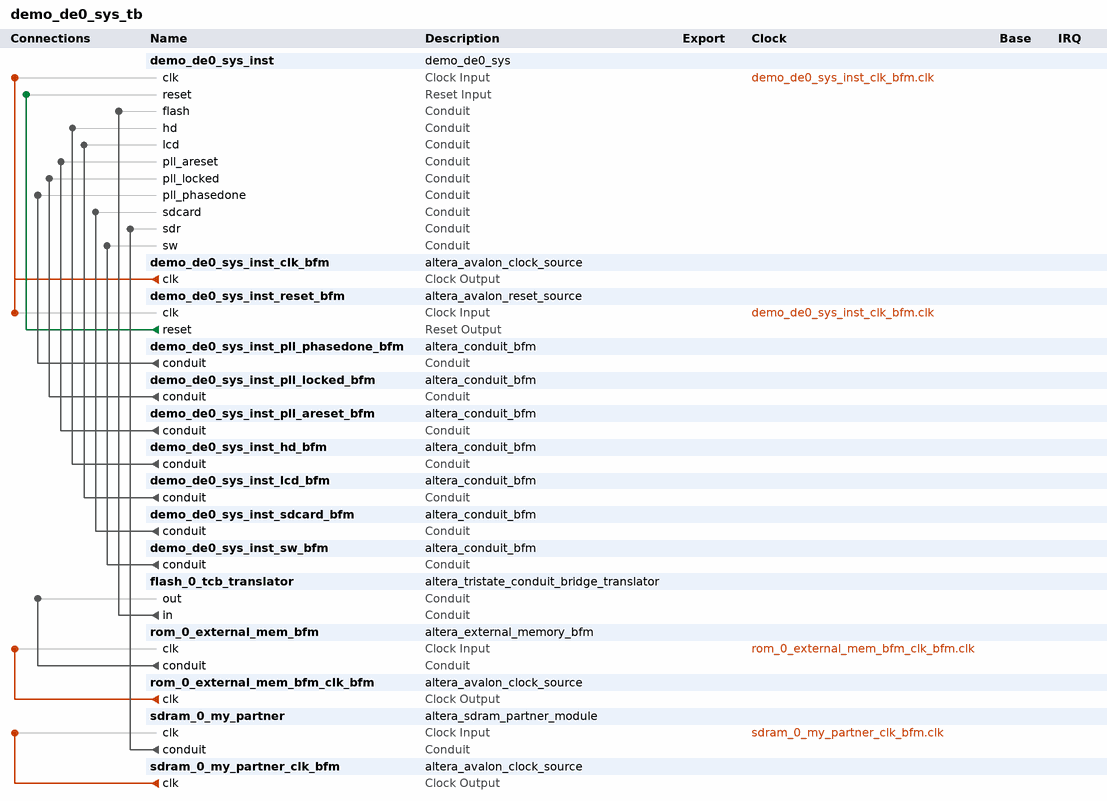
[diagram p0: system contents]
# Platform Designer (Qsys) system demo_de0_sys_tb
# Parameters at their usual value, and those the tool derives, are not listed.
package require -exact qsys 11.1
create_system demo_de0_sys_tb
set_project_property DEVICE_FAMILY CYCLONEIII

add_instance demo_de0_sys_inst demo_de0_sys 1.0

add_instance demo_de0_sys_inst_clk_bfm altera_avalon_clock_source 11.1
set_instance_parameter_value demo_de0_sys_inst_clk_bfm CLOCK_RATE 50

add_instance demo_de0_sys_inst_reset_bfm altera_avalon_reset_source 11.1
set_instance_parameter_value demo_de0_sys_inst_reset_bfm ASSERT_HIGH_RESET 0
set_instance_parameter_value demo_de0_sys_inst_reset_bfm INITIAL_RESET_CYCLES 50

add_instance demo_de0_sys_inst_pll_phasedone_bfm altera_conduit_bfm 11.1
set_instance_parameter_value demo_de0_sys_inst_pll_phasedone_bfm SIGNAL_WIDTHS 1
set_instance_parameter_value demo_de0_sys_inst_pll_phasedone_bfm SIGNAL_DIRECTIONS input

add_instance demo_de0_sys_inst_pll_locked_bfm altera_conduit_bfm 11.1
set_instance_parameter_value demo_de0_sys_inst_pll_locked_bfm SIGNAL_WIDTHS 1
set_instance_parameter_value demo_de0_sys_inst_pll_locked_bfm SIGNAL_DIRECTIONS input

add_instance demo_de0_sys_inst_pll_areset_bfm altera_conduit_bfm 11.1
set_instance_parameter_value demo_de0_sys_inst_pll_areset_bfm SIGNAL_WIDTHS 1
set_instance_parameter_value demo_de0_sys_inst_pll_areset_bfm SIGNAL_DIRECTIONS output

add_instance demo_de0_sys_inst_hd_bfm altera_conduit_bfm 11.1
set_instance_parameter_value demo_de0_sys_inst_hd_bfm SIGNAL_ROLES a,b,c,d,e,f,g,dp
set_instance_parameter_value demo_de0_sys_inst_hd_bfm SIGNAL_WIDTHS 4,4,4,4,4,4,4,4
set_instance_parameter_value demo_de0_sys_inst_hd_bfm SIGNAL_DIRECTIONS input,input,input,input,input,input,input,input

add_instance demo_de0_sys_inst_lcd_bfm altera_conduit_bfm 11.1
set_instance_parameter_value demo_de0_sys_inst_lcd_bfm SIGNAL_ROLES reset_n,cs,rs,data,write_n,read_n
set_instance_parameter_value demo_de0_sys_inst_lcd_bfm SIGNAL_WIDTHS 1,1,1,16,1,1
set_instance_parameter_value demo_de0_sys_inst_lcd_bfm SIGNAL_DIRECTIONS input,input,input,bidir,input,input

add_instance demo_de0_sys_inst_sdcard_bfm altera_conduit_bfm 11.1
set_instance_parameter_value demo_de0_sys_inst_sdcard_bfm SIGNAL_ROLES MISO,MOSI,SCLK,SS_n
set_instance_parameter_value demo_de0_sys_inst_sdcard_bfm SIGNAL_WIDTHS 1,1,1,1
set_instance_parameter_value demo_de0_sys_inst_sdcard_bfm SIGNAL_DIRECTIONS output,input,input,input

add_instance demo_de0_sys_inst_sw_bfm altera_conduit_bfm 11.1
set_instance_parameter_value demo_de0_sys_inst_sw_bfm SIGNAL_WIDTHS 12
set_instance_parameter_value demo_de0_sys_inst_sw_bfm SIGNAL_DIRECTIONS output

add_instance flash_0_tcb_translator altera_tristate_conduit_bridge_translator 11.1
set_instance_parameter_value flash_0_tcb_translator CHAIN_LENGTH 4
set_instance_parameter_value flash_0_tcb_translator MODULE_ORIGIN_LIST rom_0.tcm,rom_0.tcm,rom_0.tcm,rom_0.tcm,rom_0.tcm
set_instance_parameter_value flash_0_tcb_translator SIGNAL_ORIGIN_LIST tcm_address_out,tcm_read_n_out,tcm_write_n_out,tcm_data_out,tcm_chipselect_n_out
set_instance_parameter_value flash_0_tcb_translator SIGNAL_ORIGIN_TYPE Output,Output,Output,Bidirectional,Output
set_instance_parameter_value flash_0_tcb_translator SIGNAL_ORIGIN_WIDTH 22,1,1,16,1

add_instance rom_0_external_mem_bfm altera_external_memory_bfm 11.1
set_instance_parameter_value rom_0_external_mem_bfm USE_BYTEENABLE 0
set_instance_parameter_value rom_0_external_mem_bfm USE_CHIPSELECT 1
set_instance_parameter_value rom_0_external_mem_bfm USE_WRITE 1
set_instance_parameter_value rom_0_external_mem_bfm USE_READ 1
set_instance_parameter_value rom_0_external_mem_bfm USE_OUTPUTENABLE 0
set_instance_parameter_value rom_0_external_mem_bfm USE_BEGINTRANSFER 0
set_instance_parameter_value rom_0_external_mem_bfm USE_RESET 0
set_instance_parameter_value rom_0_external_mem_bfm ACTIVE_LOW_BYTEENABLE 0
set_instance_parameter_value rom_0_external_mem_bfm ACTIVE_LOW_CHIPSELECT 1
set_instance_parameter_value rom_0_external_mem_bfm ACTIVE_LOW_WRITE 1
set_instance_parameter_value rom_0_external_mem_bfm ACTIVE_LOW_READ 1
set_instance_parameter_value rom_0_external_mem_bfm ACTIVE_LOW_OUTPUTENABLE 0
set_instance_parameter_value rom_0_external_mem_bfm ACTIVE_LOW_BEGINTRANSFER 0
set_instance_parameter_value rom_0_external_mem_bfm ACTIVE_LOW_RESET 0
set_instance_parameter_value rom_0_external_mem_bfm SIGNAL_ADDRESS_ROLES tcm_address_out
set_instance_parameter_value rom_0_external_mem_bfm SIGNAL_DATA_ROLES tcm_data_out
set_instance_parameter_value rom_0_external_mem_bfm SIGNAL_WRITE_ROLES tcm_write_n_out
set_instance_parameter_value rom_0_external_mem_bfm SIGNAL_READ_ROLES tcm_read_n_out
set_instance_parameter_value rom_0_external_mem_bfm SIGNAL_BYTEENABLE_ROLES tcm_byteenable_out
set_instance_parameter_value rom_0_external_mem_bfm SIGNAL_CHIPSELECT_ROLES tcm_chipselect_n_out
set_instance_parameter_value rom_0_external_mem_bfm SIGNAL_OUTPUTENABLE_ROLES tcm_outputenable_out
set_instance_parameter_value rom_0_external_mem_bfm SIGNAL_BEGINTRANSFER_ROLES tcm_begintransfer_out
set_instance_parameter_value rom_0_external_mem_bfm SIGNAL_RESET_ROLES tcm_reset_out
set_instance_parameter_value rom_0_external_mem_bfm CDT_ADDRESS_W 22
set_instance_parameter_value rom_0_external_mem_bfm CDT_SYMBOL_W 8
set_instance_parameter_value rom_0_external_mem_bfm CDT_NUMSYMBOLS 2
set_instance_parameter_value rom_0_external_mem_bfm INIT_FILE altera_external_memory_bfm.hex
set_instance_parameter_value rom_0_external_mem_bfm CDT_READ_LATENCY 0

add_instance rom_0_external_mem_bfm_clk_bfm altera_avalon_clock_source 11.1
set_instance_parameter_value rom_0_external_mem_bfm_clk_bfm CLOCK_RATE 100

add_instance sdram_0_my_partner altera_sdram_partner_module 11.0
set_instance_parameter_value sdram_0_my_partner SDRAM_DATA_WIDTH 16
set_instance_parameter_value sdram_0_my_partner SDRAM_COL_WIDTH 8
set_instance_parameter_value sdram_0_my_partner SDRAM_ROW_WIDTH 12
set_instance_parameter_value sdram_0_my_partner CONTR_NAME sdram_0

add_instance sdram_0_my_partner_clk_bfm altera_avalon_clock_source 11.1
set_instance_parameter_value sdram_0_my_partner_clk_bfm CLOCK_RATE 100

# connections
add_connection demo_de0_sys_inst_clk_bfm.clk demo_de0_sys_inst.clk clock
add_connection demo_de0_sys_inst_clk_bfm.clk demo_de0_sys_inst_reset_bfm.clk clock
add_connection rom_0_external_mem_bfm_clk_bfm.clk rom_0_external_mem_bfm.clk clock
add_connection sdram_0_my_partner_clk_bfm.clk sdram_0_my_partner.clk clock
add_connection demo_de0_sys_inst_reset_bfm.reset demo_de0_sys_inst.reset reset
add_connection demo_de0_sys_inst_hd_bfm.conduit demo_de0_sys_inst.hd conduit
add_connection demo_de0_sys_inst_lcd_bfm.conduit demo_de0_sys_inst.lcd conduit
add_connection demo_de0_sys_inst_pll_areset_bfm.conduit demo_de0_sys_inst.pll_areset conduit
add_connection demo_de0_sys_inst_pll_locked_bfm.conduit demo_de0_sys_inst.pll_locked conduit
add_connection demo_de0_sys_inst_pll_phasedone_bfm.conduit demo_de0_sys_inst.pll_phasedone conduit
add_connection demo_de0_sys_inst_sdcard_bfm.conduit demo_de0_sys_inst.sdcard conduit
add_connection demo_de0_sys_inst_sw_bfm.conduit demo_de0_sys_inst.sw conduit
add_connection flash_0_tcb_translator.in demo_de0_sys_inst.flash conduit
add_connection rom_0_external_mem_bfm.conduit flash_0_tcb_translator.out conduit
add_connection sdram_0_my_partner.conduit demo_de0_sys_inst.sdr conduit

save_system demo_de0_sys_tb.qsys
